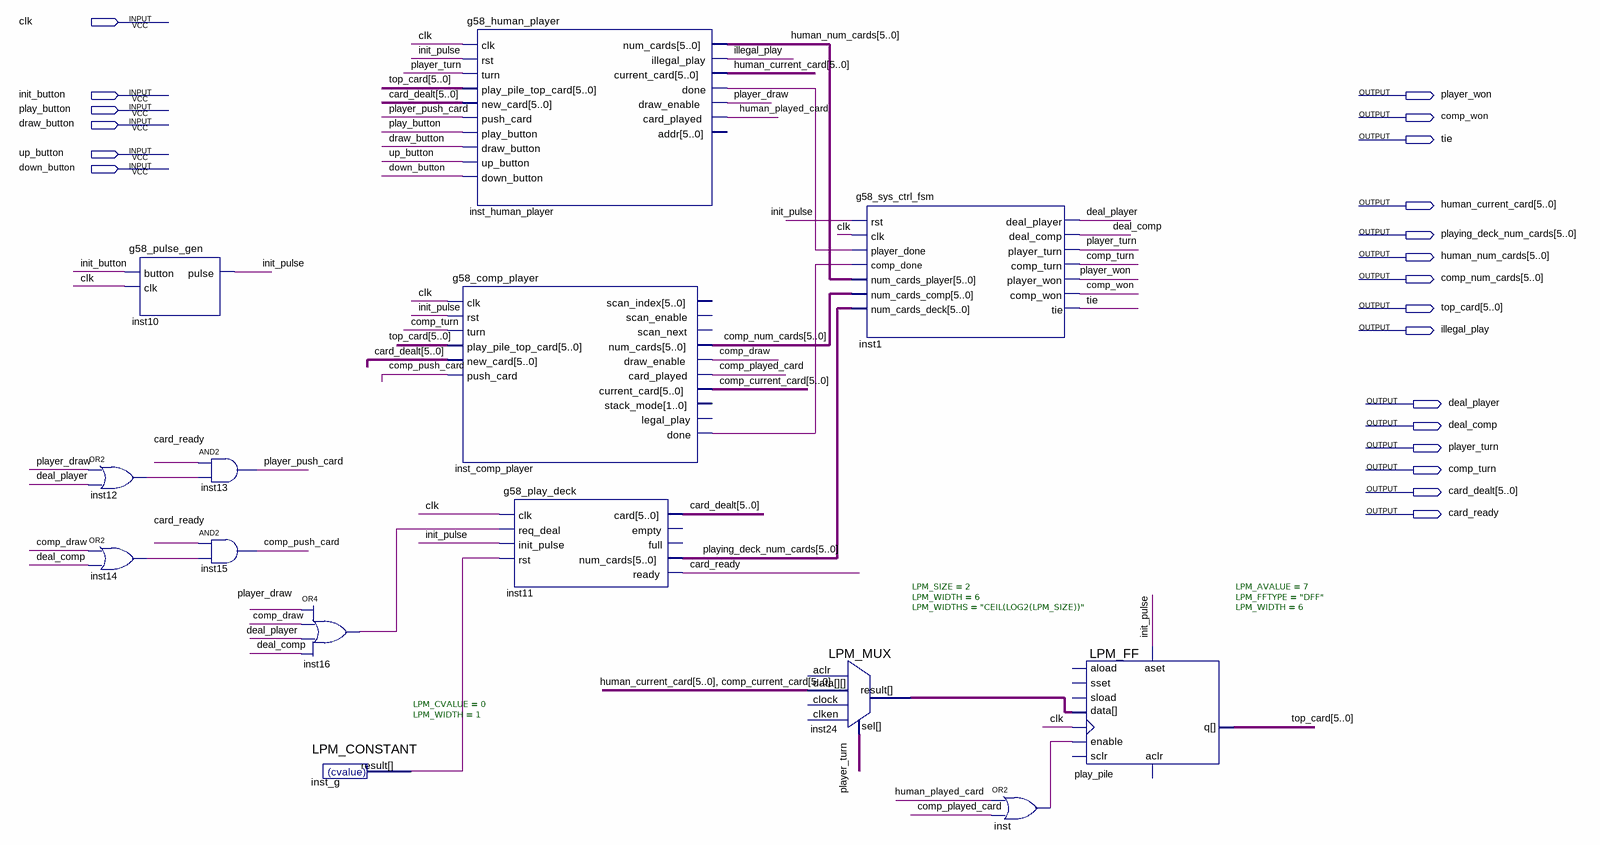
[diagram p0: schematic sheet]
// Quartus schematic g58_crazy8.bdf as structural Verilog: 14 symbols, 21 pins
module g58_crazy8 (
  input  clk,
  input  init_button,
  input  play_button,
  input  draw_button,
  input  up_button,
  input  down_button,
  output player_won,
  output comp_won,
  output tie,
  output [5:0] human_current_card,
  output [5:0] playing_deck_num_cards,
  output [5:0] human_num_cards,
  output [5:0] comp_num_cards,
  output [5:0] top_card,
  output illegal_play,
  output deal_player,
  output deal_comp,
  output player_turn,
  output comp_turn,
  output [5:0] card_dealt,
  output card_ready
);

  wire comp_draw, comp_played_card, comp_push_card, human_played_card, init_pulse, inst12_out, inst14_out,
       inst16_out, inst_comp_player_done, inst_g_result, inst_human_player_done, inst_out, player_draw,
       player_push_card;
  wire [5:0] comp_current_card, inst24_result;

  or inst12 (inst12_out, player_draw, deal_player);
  or inst14 (inst14_out, comp_draw, deal_comp);
  g58_pulse_gen inst10 (.button(init_button), .clk(clk), .pulse(init_pulse));
  and inst13 (player_push_card, card_ready, inst12_out);
  and inst15 (comp_push_card, card_ready, inst14_out);
  or inst16 (inst16_out, player_draw, comp_draw, deal_player, deal_comp);
  LPM_CONSTANT #(.LPM_CVALUE(0), .LPM_WIDTH(1)) inst_g (.result(inst_g_result));
  g58_comp_player inst_comp_player (
    .clk(clk), .rst(init_pulse), .turn(comp_turn), .play_pile_top_card(top_card), .new_card(card_dealt),
    .push_card(comp_push_card), .num_cards(comp_num_cards), .draw_enable(comp_draw),
    .card_played(comp_played_card), .current_card(comp_current_card), .done(inst_comp_player_done));  // open: scan_index, scan_enable, scan_next, stack_mode, legal_play
  g58_human_player inst_human_player (
    .clk(clk), .rst(init_pulse), .turn(player_turn), .play_pile_top_card(top_card), .new_card(card_dealt),
    .push_card(player_push_card), .play_button(play_button), .draw_button(draw_button),
    .up_button(up_button), .down_button(down_button), .num_cards(human_num_cards),
    .illegal_play(illegal_play), .current_card(human_current_card), .done(inst_human_player_done),
    .draw_enable(player_draw), .card_played(human_played_card));  // open: addr
  g58_play_deck inst11 (
    .clk(clk), .req_deal(inst16_out), .init_pulse(init_pulse), .rst(inst_g_result), .card(card_dealt),
    .num_cards(playing_deck_num_cards), .ready(card_ready));  // open: empty, full
  g58_sys_ctrl_fsm inst1 (
    .rst(init_pulse), .clk(clk), .player_done(inst_human_player_done), .comp_done(inst_comp_player_done),
    .num_cards_player(human_num_cards), .num_cards_comp(comp_num_cards),
    .num_cards_deck(playing_deck_num_cards), .deal_player(deal_player), .deal_comp(deal_comp),
    .player_turn(player_turn), .comp_turn(comp_turn), .player_won(player_won), .comp_won(comp_won), .tie(tie));
  LPM_MUX #(.LPM_SIZE(2), .LPM_WIDTH(6), .LPM_WIDTHS("CEIL(LOG2(LPM_SIZE))")) inst24 (
    .data({human_current_card, comp_current_card}), .sel(player_turn), .result(inst24_result));  // open: clock, aclr, clken
  or inst (inst_out, human_played_card, comp_played_card);
  LPM_FF #(.LPM_AVALUE(7), .LPM_FFTYPE("DFF"), .LPM_WIDTH(6)) play_pile (
    .enable(inst_out), .clock(clk), .aset(init_pulse), .data(inst24_result), .q(top_card));  // open: aload, sset, sload, sclr, aclr
endmodule
